# Altium schematic sheet 松菸_幻影光靈_屍禁_提燈_20241105.SchDoc
size A4
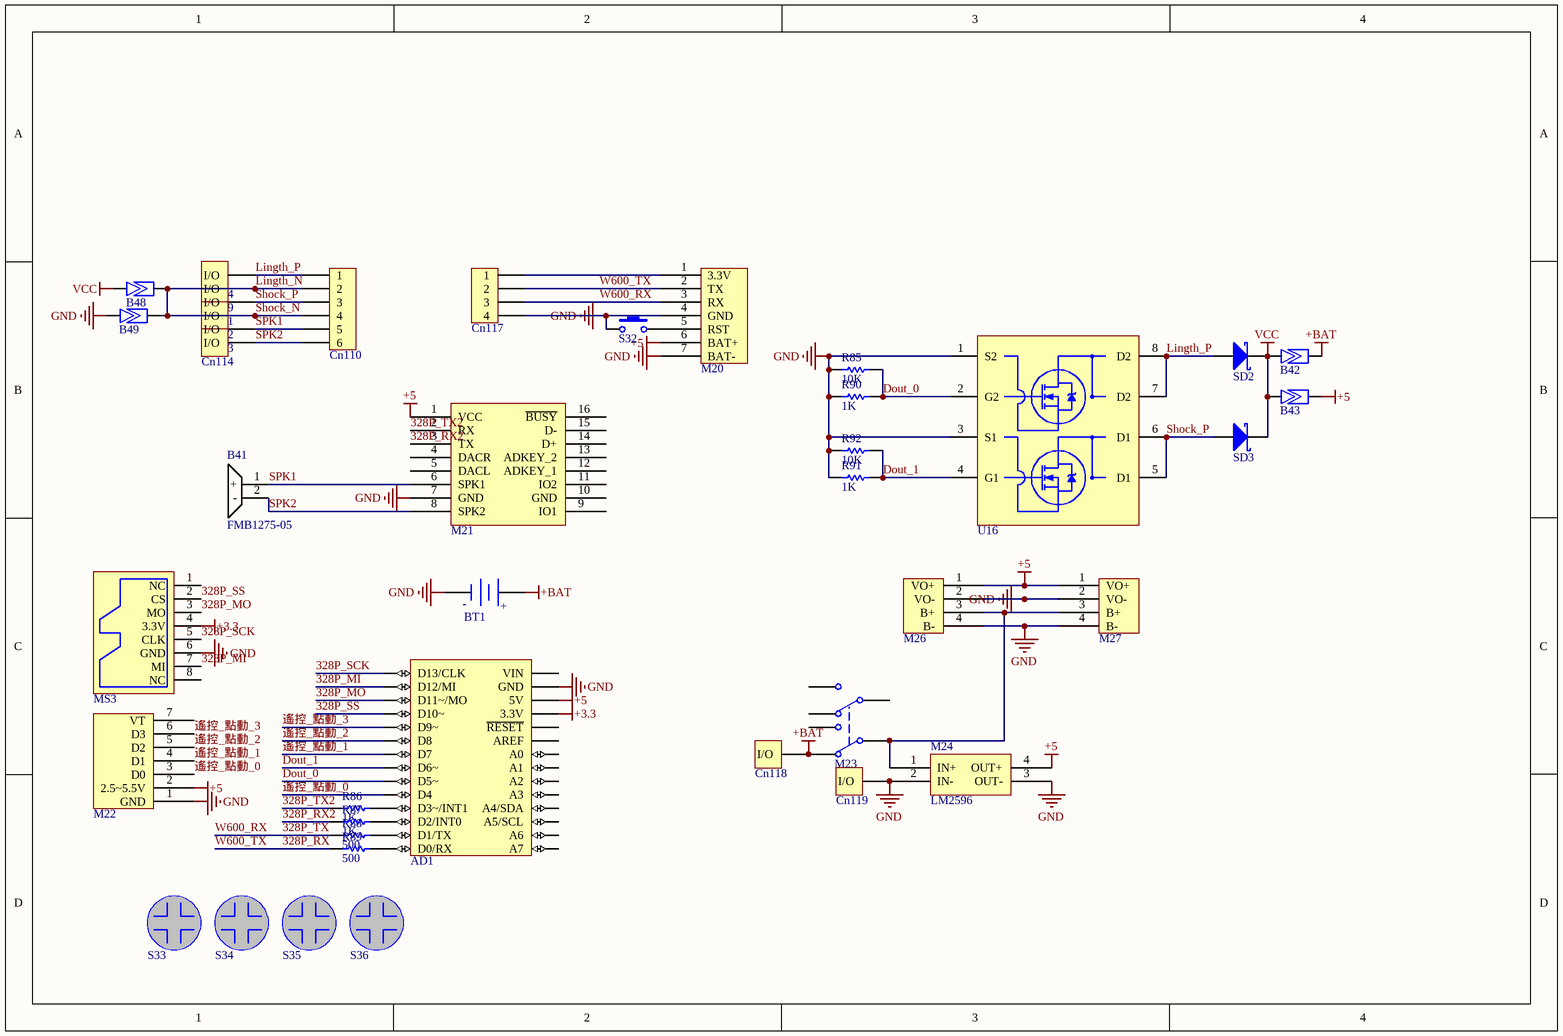
[diagram p0: 松菸_幻影光靈_屍禁_提燈_20241105.SchDoc]

## Parts
AD1  Arduino NANO  [Arduino NANO]  (value not drawn)
B41  FMB1275-05  [Buzzer_12085]
B42  短路  [BYPASS-0805]  (value not drawn)
B43  短路  [BYPASS-0805]  (value not drawn)
B48  短路  [BYPASS-0805]  (value not drawn)
B49  短路  [BYPASS-0805]  (value not drawn)
BT1  18650  [Battery_18650]  (value not drawn)
Cn104  Contact  [Conntact_Stamp hole_0.6"]  (value not drawn)
Cn109  Contact  [Conntact_Stamp hole_0.6"]  (value not drawn)
Cn110  KF2510-6  [Connector_KF2510-6A]  (value not drawn)
Cn111  Contact  [Conntact_Stamp hole_0.6"]  (value not drawn)
Cn112  Contact  [Conntact_Stamp hole_0.6"]  (value not drawn)
Cn113  Contact  [Conntact_Stamp hole_0.6"]  (value not drawn)
Cn114  Contact  [Conntact_Stamp hole_0.6"]  (value not drawn)
Cn117  KF2510-4  [Connector_KF2510-4A]  (value not drawn)
Cn118  Contact  [Conntact_Stamp hole_0.6"]  (value not drawn)
Cn119  Contact  [Conntact_Stamp hole_0.6"]  (value not drawn)
M20  HH_W600_V2.0  [HH_W600_V2.0]  (value not drawn)
M21  mp3-tf-16p  [BY8001-16P]  (value not drawn)
M22  XR390  [XR390 Module]  (value not drawn)
M23  MST22D18G2  [Switch_MST22D18G2]  (value not drawn)
M24  LM2596  [LM2596 Module]
M26  4056+LN2220PAR_Module  [4056H+DW01A_Module]  (value not drawn)
M27  4056+LN2220PAR_Module  [4056H+DW01A_Module]  (value not drawn)
MS3  Interface_MicroSD card slot  [Interface_MicroSD card slot]  (value not drawn)
R85  10K  [Res-1206]
R86  1K  [Res-1206]
R87  1K  [Res-1206]
R88  500  [Res-1206]
R89  500  [Res-1206]
R90  1K  [Res-1206]
R91  1K  [Res-1206]
R92  10K  [Res-1206]
S32  Switch  [Switch SMD-3.6*6*2.5]  (value not drawn)
S33  M3  [Screw M3]  (value not drawn)
S34  M3  [Screw M3]  (value not drawn)
S35  M3  [Screw M3]  (value not drawn)
S36  M3  [Screw M3]  (value not drawn)
SD2  SS56  [Diode_SMA]  (value not drawn)
SD3  SS56  [Diode_SMA]  (value not drawn)
U16  AO4800  [SOP-8]  (value not drawn)

## Nets
+3.3: AD1.5(3.3V) MS3.4(3.3V)
+5: AD1.3(5V) B43.1 M20.6(BAT+) M21.1(VCC) M22.2(2.5~5.5V) M24.4(OUT+) M26.1(VO+) M27.1(VO+)
+BAT: B42.1 BT1.1(+) Cn118.1(I/O) M23.2
GND: AD1.2(GND) B49.2 BT1.2(-) Cn117.4 Cn119.1(I/O) M20.4(GND) M20.7(BAT-) M21.7(GND) M22.1(GND) M24.2(IN-) M24.3(OUT-) M26.2(VO-) M26.4(B-) M27.2(VO-) M27.4(B-) MS3.6(GND) R85.1 R90.1 R91.1 R92.1 S32.1 U16.1(S2) U16.3(S1)
VCC: B42.2 B43.2 B48.2 SD2.1(K) SD3.1(K)
328P_MI: AD1.19(D12/MI) MS3.7(MI)
328P_MO: AD1.18(D11~/MO) MS3.3(MO)
328P_RX: Cn117.2 M20.2(TX) R89.1  [also labelled W600_TX]
328P_RX2: M21.3(TX) R87.1
328P_SCK: AD1.20(D13/CLK) MS3.5(CLK)
328P_SS: AD1.17(D10~) MS3.2(CS)
328P_TX: Cn117.3 M20.3(RX) R88.1  [also labelled W600_RX]
328P_TX2: M21.2(RX) R86.1
Dout_0: AD1.12(D5~) R85.2 R90.2 U16.2(G2)
Dout_1: AD1.13(D6~) R91.2 R92.2 U16.4(G1)
Lingth_N: B48.1 B49.1 Cn109.1(I/O) Cn110.2 Cn110.4 Cn112.1(I/O)  [also labelled Shock_N]
Lingth_P: Cn104.1(I/O) Cn110.1 SD2.2(A) U16.7(D2) U16.8(D2)
Shock_P: Cn110.3 Cn111.1(I/O) SD3.2(A) U16.5(D1) U16.6(D1)
SPK1: B41.1(+) Cn110.5 Cn113.1(I/O) M21.6(SPK1)
SPK2: B41.2(-) Cn110.6 Cn114.1(I/O) M21.8(SPK2)
遙控_點動_0: AD1.11(D4) M22.3(D0)
遙控_點動_1: AD1.14(D7) M22.4(D1)
遙控_點動_2: AD1.15(D8) M22.5(D2)
遙控_點動_3: AD1.16(D9~) M22.6(D3)
NetAD1_7: AD1.7(D0/RX) R89.2
NetAD1_8: AD1.8(D1/TX) R88.2
NetAD1_9: AD1.9(D2/INT0) R87.2
NetAD1_10: AD1.10(D3~/INT1) R86.2
NetCn117_1: Cn117.1 M20.1(3.3V)
NetM20_5: M20.5(RST) S32.2
NetM23_1: M23.1 M24.1(IN+) M26.3(B+) M27.3(B+)

Not connected (* = marked no-connect by the designer): AD1 1(VIN) 4(~{RESET}) 6(AREF) 21(A0) 22(A1) 23(A2) 24(A3) 25(A4/SDA) 26(A5/SCL) 27(A6) 28(A7); M21 4(DACR) 5(DACL) 9(IO1) 10(GND) 11(IO2) 12(ADKEY_1) 13(ADKEY_2) 14(D+) 15(D-) 16(~{BUSY}); M22 7(VT); M23 3 4 5 6; MS3 1(NC) 8(NC)

## Library data of the parts
AD1 = Arduino NANO: 單晶片
B41 = Buzzer: 無源蜂鳴器
B42 B43 B48 B49 = Bypass: 短路焊點(如標註短路則需額外補錫使其短路)
BT1 = Battery: 電池
Cn104 Cn109 Cn111-Cn114 Cn118 Cn119 = Conntact: 接線端子、接點、郵票孔(非焊接元件)
Cn110 = Conntact(6P): 連接器
Cn117 = Conntact(4P): 連接器
M21 = Mini MP3 Player: TTL通訊SD卡撥放mp3模組; ComponentLink1Description: datasheet; ComponentLink1URL: http://www.electronicoscaldas.com/datasheet/DFR0299-DFPlayer-Mini-Manual.pdf
M22 = XR390: 遙控器模組
M23 = Switch_Slide_2: 開關_滑動_2通道
M24 = LM2596_Moduld: DC to DC 降壓模組
M26 M27 = 4056+LN2220PAR_Module: 鋰電池充電升壓模組
MS3 = Interface_MicroSD card slot: Micro SD 卡座
R85-R92 = Res: 電阻
S32 = Switch: 開關_按鍵
S33-S36 = Screw: 螺絲(非焊接元件)
SD2 SD3 = Diode_Schottky: 二極體_蕭特基
U16 = MOS_Dual N_AO4800: MOS,雙NMOS